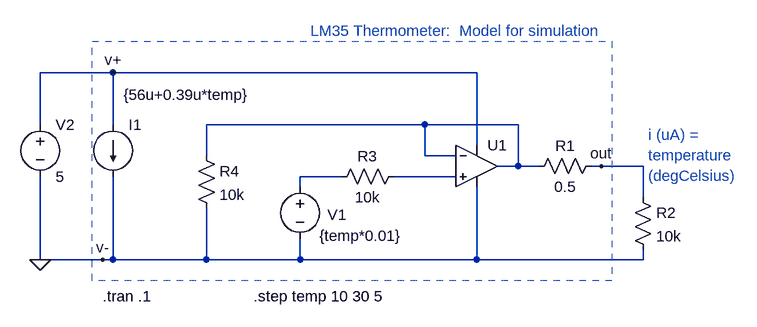
[diagram p0: schematic LM35 my model.asc]
LM35 my model.asc, the LTspice schematic file:
Version 4
SHEET 1 1020 680
WIRE -224 -96 -336 -96
WIRE 336 -96 -224 -96
WIRE -336 -16 -336 -96
WIRE -224 -16 -224 -96
WIRE 256 -16 -80 -16
WIRE 400 -16 256 -16
WIRE 336 16 336 -96
WIRE -80 32 -80 -16
WIRE 256 32 256 -16
WIRE 304 32 256 32
WIRE 400 48 400 -16
WIRE 400 48 368 48
WIRE 432 48 400 48
WIRE 528 48 512 48
WIRE 592 48 528 48
WIRE 128 64 64 64
WIRE 304 64 208 64
WIRE 64 80 64 64
WIRE 592 96 592 48
WIRE -336 192 -336 64
WIRE -240 192 -336 192
WIRE -224 192 -224 64
WIRE -224 192 -240 192
WIRE -80 192 -80 112
WIRE -80 192 -224 192
WIRE 64 192 64 160
WIRE 64 192 -80 192
WIRE 336 192 336 80
WIRE 336 192 64 192
WIRE 592 192 592 176
WIRE 592 192 336 192
FLAG -224 -96 v+
FLAG -240 192 v-
FLAG 528 48 out
FLAG -336 192 0
SYMBOL voltage 64 64 R0
WINDOW 0 42 59 Left 0
WINDOW 3 30 91 Left 0
WINDOW 123 0 0 Left 0
WINDOW 39 59 72 Left 0
SYMATTR InstName V1
SYMATTR Value {temp*0.01}
SYMBOL Opamps\\UniversalOpamp2 336 48 R0
SYMATTR InstName U1
SYMBOL current -224 -16 R0
WINDOW 3 16 -46 Left 0
WINDOW 123 0 0 Left 0
WINDOW 39 0 0 Left 0
SYMATTR Value {56u+0.39u*temp}
SYMATTR InstName I1
SYMBOL res 528 32 R90
WINDOW 0 0 56 VBottom 0
WINDOW 3 32 56 VTop 0
SYMATTR InstName R1
SYMATTR Value 0.5
SYMBOL res 224 48 R90
WINDOW 0 0 56 VBottom 0
WINDOW 3 32 56 VTop 0
SYMATTR InstName R3
SYMATTR Value 10k
SYMBOL res -96 16 R0
SYMATTR InstName R4
SYMATTR Value 10k
SYMBOL res 576 80 R0
SYMATTR InstName R2
SYMATTR Value 10k
SYMBOL voltage -336 -32 R0
WINDOW 123 0 0 Left 0
WINDOW 39 0 0 Left 0
SYMATTR InstName V2
SYMATTR Value 5
TEXT -8 248 Left 0 !.step temp 10 30 5
TEXT -240 248 Left 0 !.tran .1
TEXT 80 -160 Left 0 ;LM35 Thermometer:  Model for simulation
TEXT 600 0 Left 0 ;i (uA) = \ntemperature\n(degCelsius)
RECTANGLE Normal 544 224 -256 -144 1

The netlist it stands for:
* LM35 my model.asc
V1 N002 0 {temp*0.01}
XU1 N003 N001 v+ 0 N001 level.2 Avol=1Meg GBW=10Meg Slew=10Meg ilimit=25m rail=0 Vos=0 phimargin=45 en=0 enk=0 in=0 ink=0 Rin=500Meg  ; pins IN+ IN- V+ V- OUT
I1 v+ 0 {56u+0.39u*temp}
R1 out N001 0.5
R3 N003 N002 10k
R4 N001 0 10k
R2 out 0 10k
V2 v+ 0 5
.step temp 10 30 5
.tran .1
* LM35 Thermometer:  Model for simulation
* i (uA) =
* temperature
* (degCelsius)
.lib UniversalOpamps2.sub
.backanno
.end